# Altium schematic sheet MAIN_MCU_CT2650.SchDoc
size B
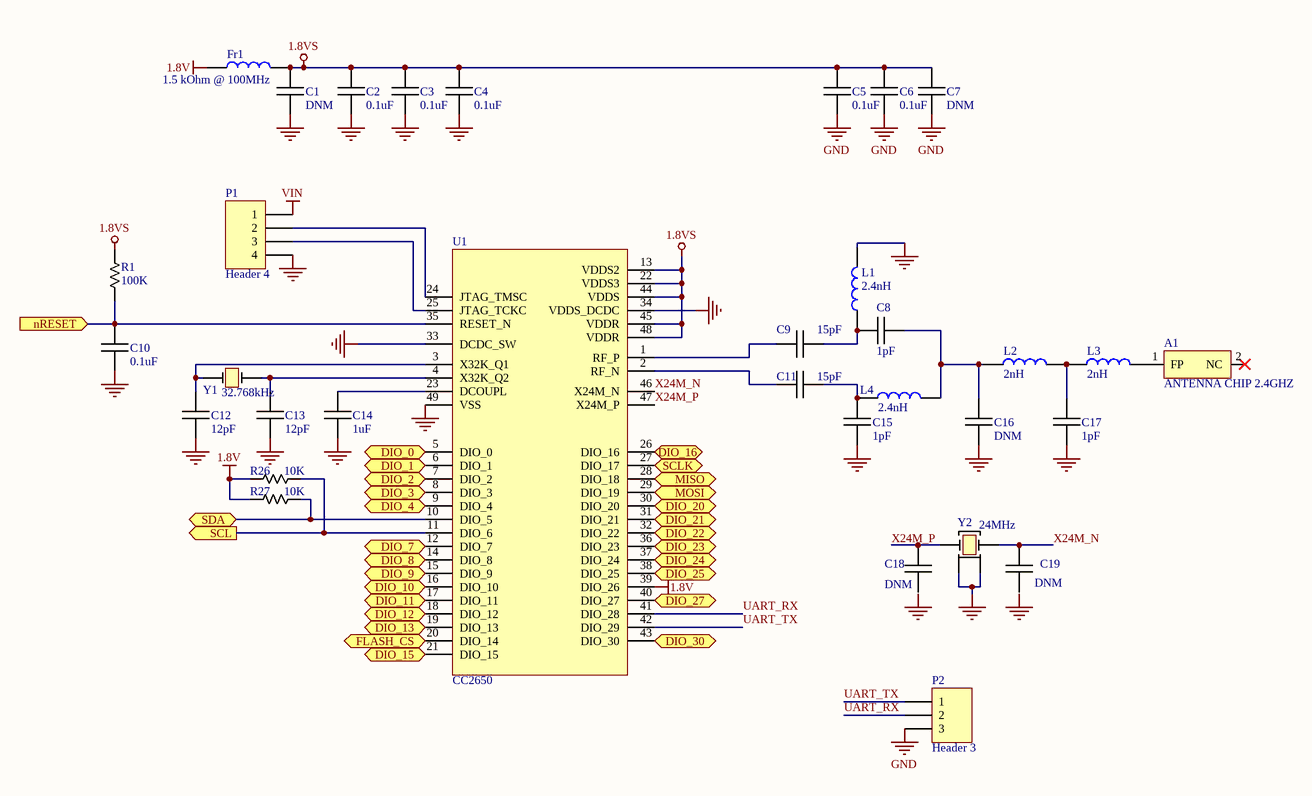
[diagram p0: MAIN_MCU_CT2650.SchDoc]

## Parts
A1  ANTENNA CHIP 2.4GHZ
C1  DNM
C2  0.1uF
C3  0.1uF
C4  0.1uF
C5  0.1uF
C6  0.1uF
C7  DNM
C8  1pF
C9  15pF
C10  0.1uF
C11  15pF
C12  12pF
C13  12pF
C14  1uF
C15  1pF
C16  DNM
C17  1pF
C18  DNM
C19  DNM
Fr1  1.5 kOhm @ 100MHz
L1  2.4nH
L2  2nH
L3  2nH
L4  2.4nH
P1  Header 4  [HDR1X4]
P2  Header 3  [HDR1X3]
R1  100K  [R0603]
R26  10K  [R0603]
R27  10K  [R0603]
U1  CC2650
Y1  32.768kHz
Y2  24MHz

## Ports
DIO_0 (bidir), DIO_1 (bidir), DIO_2 (bidir), DIO_3 (bidir), DIO_4 (bidir), DIO_7 (bidir), DIO_8 (bidir), DIO_9 (bidir), DIO_10 (bidir), DIO_11 (bidir), DIO_12 (bidir), DIO_13 (bidir), DIO_15 (bidir), DIO_16 (bidir), DIO_20 (bidir), DIO_21 (bidir), DIO_22 (bidir), DIO_23 (bidir), DIO_24 (bidir), DIO_25 (bidir), DIO_27 (bidir), DIO_30 (bidir), FLASH_CS (bidir), MISO (in), MOSI (out), nRESET (in), SCL (out), SCLK (bidir), SDA (bidir)

## Nets
1.8V: Fr1.1 R26.1 R27.1 U1.39(DIO_26)
1.8VS: C1.2 C2.2 C3.2 C4.2 C5.2 C6.2 C7.2 Fr1.2 R1.2 U1.13(VDDS2) U1.22(VDDS3) U1.44(VDDS) U1.45(VDDR) U1.48(VDDR)
GND: C1.1 C2.1 C3.1 C4.1 C5.1 C6.1 C7.1 C10.1 C12.1 C13.1 C14.1 C15.1 C16.1 C17.1 L1.2 P1.4 P2.3 U1.33(DCDC_SW) U1.34(VDDS_DCDC) U1.49(VSS) Y2.2 Y2.4
VIN: P1.1
DIO_0: U1.5(DIO_0) ; port DIO_0
DIO_1: U1.6(DIO_1) ; port DIO_1
DIO_2: U1.7(DIO_2) ; port DIO_2
DIO_3: U1.8(DIO_3) ; port DIO_3
DIO_4: U1.9(DIO_4) ; port DIO_4
DIO_7: U1.12(DIO_7) ; port DIO_7
DIO_8: U1.14(DIO_8) ; port DIO_8
DIO_9: U1.15(DIO_9) ; port DIO_9
DIO_10: U1.16(DIO_10) ; port DIO_10
DIO_11: U1.17(DIO_11) ; port DIO_11
DIO_12: U1.18(DIO_12) ; port DIO_12
DIO_13: U1.19(DIO_13) ; port DIO_13
DIO_15: U1.21(DIO_15) ; port DIO_15
DIO_16: U1.26(DIO_16) ; port DIO_16
DIO_20: U1.30(DIO_20) ; port DIO_20
DIO_21: U1.31(DIO_21) ; port DIO_21
DIO_22: U1.32(DIO_22) ; port DIO_22
DIO_23: U1.36(DIO_23) ; port DIO_23
DIO_24: U1.37(DIO_24) ; port DIO_24
DIO_25: U1.38(DIO_25) ; port DIO_25
DIO_27: U1.40(DIO_27) ; port DIO_27
DIO_30: U1.43(DIO_30) ; port DIO_30
FLASH_CS: U1.20(DIO_14) ; port FLASH_CS
MISO: U1.28(DIO_18) ; port MISO
MOSI: U1.29(DIO_19) ; port MOSI
nRESET: C10.2 R1.1 U1.35(RESET_N) ; port nRESET
SCL: R26.2 U1.11(DIO_6) ; port SCL
SCLK: U1.27(DIO_17) ; port SCLK
SDA: R27.2 U1.10(DIO_5) ; port SDA
UART_RX: P2.2 U1.41(DIO_28)
UART_TX: P2.1 U1.42(DIO_29)
X24M_N: U1.46(X24M_N)
X24M_P: U1.47(X24M_P)
NetA1_1: A1.1(FP) L3.2
NetC8_1: C8.1 C9.2 L1.1
NetC8_2: C8.2 C16.2 L2.1 L4.2
NetC9_1: C9.1 U1.1(RF_P)
NetC11_1: C11.1 U1.2(RF_N)
NetC11_2: C11.2 C15.2 L4.1
NetC12_2: C12.2 U1.3(X32K_Q1) Y1.1
NetC13_2: C13.2 U1.4(X32K_Q2) Y1.2
NetC14_2: C14.2 U1.23(DCOUPL)
NetC17_2: C17.2 L2.2 L3.1
NetC18_2: C18.2 Y2.1
NetC19_2: C19.2 Y2.3
NetP1_2: P1.2 U1.24(JTAG_TMSC)
NetP1_3: P1.3 U1.25(JTAG_TCKC)

Not connected (* = marked no-connect by the designer): A1 2(NC)*; C18 1; C19 1

## Notes on the sheet
- Labels drawn without touching a wire or pin: GND, X24M_N, X24M_P

## Library data of the parts
C1 C7 C16 C18 C19 = DNM: SMD_CAPACITOR; Packet: 0402; Capacitance: DNM
C2-C6 C10 = C0.1uF_0402: SMD_CAPACITOR; Voltage - Rated: 6.3V; Tolerance: ±10%; Packet: 0402; Digi-Key Part Number: 490-6319-1-ND; Capacitance: 0.1uF
C8 C15 C17 = C1pF_0402: SMD_CAPACITOR; Voltage - Rated: 50V; Tolerance: ±0.25pF; Packet: 0402; Digi-Key Part Number: 490-3199-1-ND; Capacitance: 1pF
C9 C11 = C15pF_0603: SMD_CAPACITOR; Voltage - Rated: 50V; Tolerance: ±5%; Packet: 0402; Digi-Key Part Number: 712-1261-1-ND; Capacitance: 15pF
C12 C13 = C12pF_0402: SMD_CAPACITOR; Voltage - Rated: 50V; Tolerance: ±5%; Packet: 0402; Digi-Key Part Number: 490-5924-1-ND; Capacitance: 12pF
C14 = C1uF_0402: SMD_CAPACITOR; Voltage - Rated: 10V; Tolerance: ±10%; Packet: 0402; Digi-Key Part Number: 490-3890-1-ND; Capacitance: 1uF
Fr1 = Fr1.5 kOhm: SMD_Ferrite Beads; Digi-Key Part Number: 490-5216-1-ND; Inductance: 1.5 kOhm @ 100MHz; Package: 0603
L1 L4 = L2.4nH_0402: SMD_Inductor; Digi-Key Part Number: 490-8389-1-ND; Inductance: 2.4nH; Package: 0402
L2 L3 = L2nH_0402: SMD_Inductor; Digi-Key Part Number: 490-6569-1-ND; Inductance: 2nH; Package: 0402
P1 = Header 4: Header, 4-Pin; LatestRevisionDate: 17-Jul-2002; LatestRevisionNote: Re-released for DXP Platform.; Publisher: Altium Limited
P2 = Header 3: Header, 3-Pin; LatestRevisionDate: 17-Jul-2002; LatestRevisionNote: Re-released for DXP Platform.; Publisher: Altium Limited
R1 = R100K_0402: SMD_RESISTOR; Packet: 0402; Tolerance: ±5%; Power: 1/16W; Digi-Key Part Number: 541-2190-1-ND; Value: 100K
R26 R27 = R10K_0201: SMD_RESISTOR; Packet: 0201; Tolerance: ±5%; Power: 1/20W; Digi-Key Part Number: 311-10KNCT-ND; Value: 10K
U1 = CC2650F128RGZR: IC RF TXRX+MCU 802.15.4/BT 48QFN; Packet: 48-VFQFN Exposed Pad; Digi-Key Part Number: 296-44316-1-ND
Y1 = 32.7680KHz_SMD: Crystal; Load Capacitance: 12.5pF; Frequency: 32.768kHz; Digi-Key Part Number: SER4077CT-ND
Y2 = 24MHz_SMD: Crystal; Load Capacitance: 9pF; Frequency: 24MHz; Digi-Key Part Number: SER3635CT-ND
A1 = ANTENNA CHIP 2.4GHZ: Digi-Key Part Number: 712-1006-1-ND